# EAGLE design goodfet31L (EAGLE 5.08)
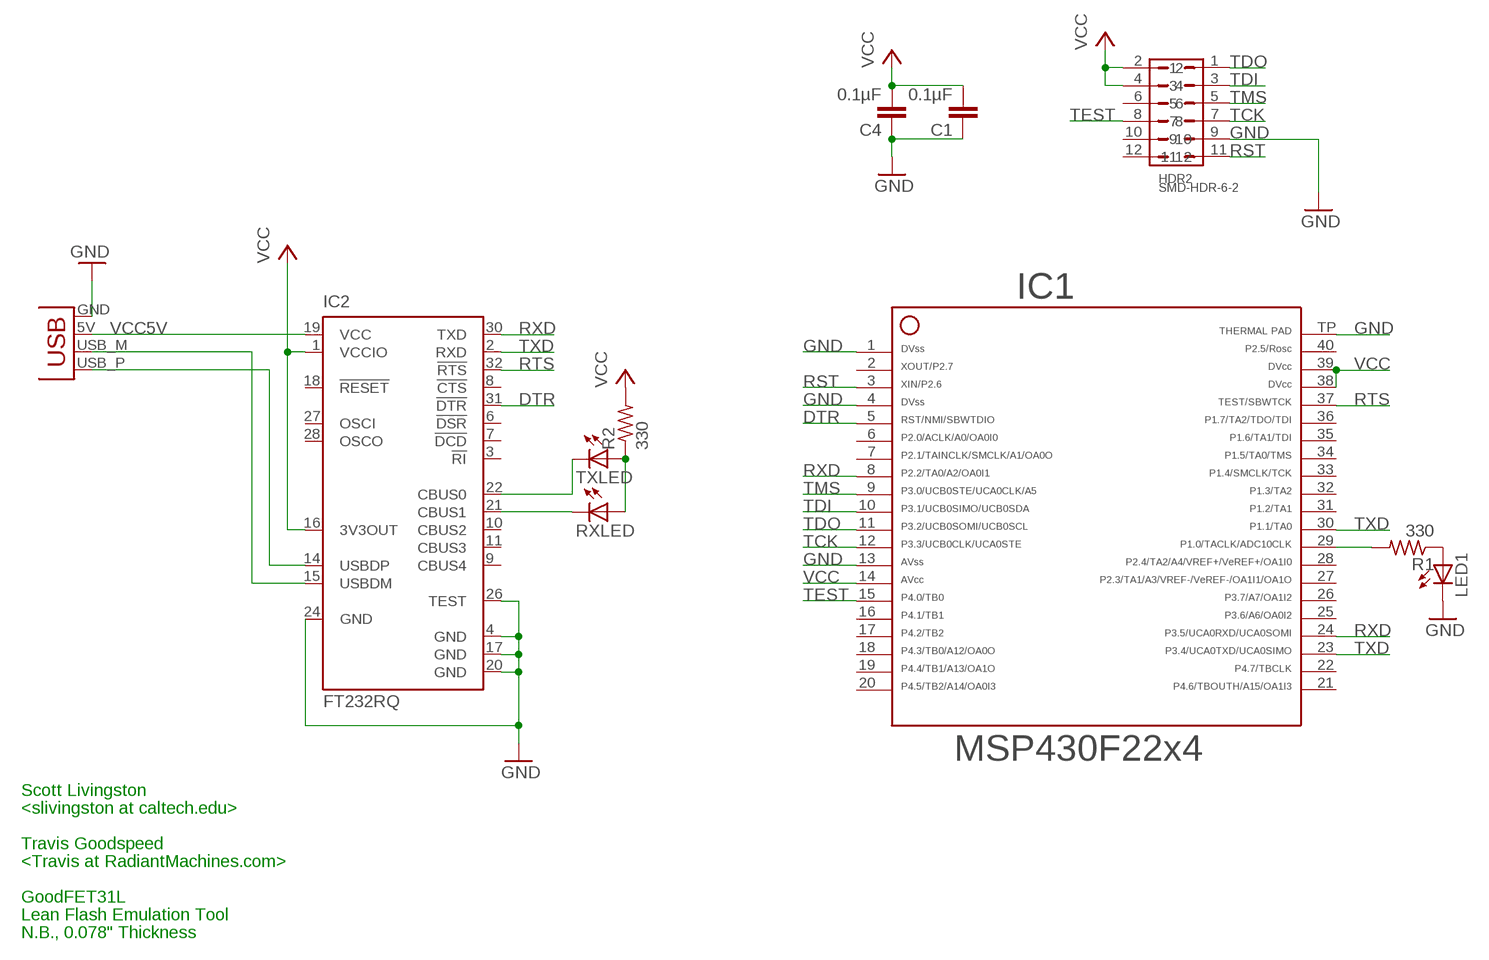
[diagram p0: schematic, sheet 1]

## Parts
C1  0.1µF  C-EUC0603  [C0603]
C4  0.1µF  C-EUC0603  [C0603]
HDR2  SMD-HDR-6-2  [SMD-HDR-6-2]
IC1  F22X4---RHA40  [RHA40]
IC2  FT232RQ  [QFN32]
LED1  LEDCHIP-LED0603  [CHIP-LED0603]
R1  330  R-US_R0603  [R0603]
R2  330  R-US_R0603  [R0603]
RXLED  LEDCHIP-LED0603  [CHIP-LED0603]
TXLED  LEDCHIP-LED0603  [CHIP-LED0603]
X1  USBPCB  [USB-A-PCB]

## Nets
DTR: IC1.5 IC2.31(!DTR)
GND: C1.1 C4.1 HDR2.9 IC1.1 IC1.4 IC1.13 IC1.TP IC2.4(GND) IC2.17(GND) IC2.20(GND) IC2.24(GND) IC2.26(TEST) LED1.C X1.GND
N$1: IC1.29 R1.2
N$2: IC2.21(CBUS1) RXLED.C
N$3: IC2.14(USBDP) X1.USB_P(D+)
N$4: IC2.15(USBDM) X1.USB_M(D-)
N$5: IC2.22(CBUS0) TXLED.C
N$8: R2.1 RXLED.A TXLED.A
N$10: LED1.A R1.1
RST: HDR2.11 IC1.3
RTS: IC1.37 IC2.32(!RTS)
RXD: IC1.8 IC1.24 IC2.30(TXD)
TCK: HDR2.7 IC1.12
TDI: HDR2.3 IC1.10
TDO: HDR2.1 IC1.11
TEST: HDR2.8 IC1.15
TMS: HDR2.5 IC1.9
TXD: IC1.23 IC1.30 IC2.2(RXD)
VCC: C1.2 C4.2 HDR2.2 HDR2.4 IC1.14 IC1.38 IC1.39 IC2.1(VCCIO) IC2.16(3V3OUT) R2.2
VCC5V: IC2.19(VCC) X1.5V(VBUS)
Unconnected: HDR2.6 HDR2.10 HDR2.12 IC1.2 IC1.6 IC1.7 IC1.16 IC1.17 IC1.18 IC1.19 IC1.20 IC1.21 IC1.22 IC1.25 IC1.26 IC1.27 IC1.28 IC1.31 IC1.32 IC1.33 IC1.34 IC1.35 IC1.36 IC1.40 IC2.3(!RI) IC2.6(!DSR) IC2.7(!DCD) IC2.8(!CTS) IC2.9(CBUS4) IC2.10(CBUS2) IC2.11(CBUS3) IC2.18(!RESET) IC2.27(OSCI) IC2.28(OSCO)

## Notes on the sheet
- Scott Livingston
- <slivingston at caltech.edu>
- Travis Goodspeed
- <Travis at RadiantMachines.com>
- GoodFET31L
- Lean Flash Emulation Tool
- N.B., 0.078" Thickness

## Library data of the parts
C1 C4 = rcl:C-EU: CAPACITOR, European symbol
HDR2 = scott_eagle:SMD-HDR-6-2
IC1 = TI_MSP430_v13:F22X4---RHA40: ***MSP430F22x4***RHA40
IC2 = ftdichip:FT232R: Source: http://www.ftdichip.com/Documents/DataSheets/DS_FT232R_v104.pdf
LED1 RXLED TXLED = led:LED: LED OSRAM: - CHIPLED LG R971, LG N971, LY N971, LG Q971, LY Q971, LO R971, LY R971 LH N974, LH R974 LS Q976, LO Q976, LY Q976 LO Q996 - Hyper CHIPLED LW Q18S LB Q993, LB Q99A, LB R99A - SideLED LS A670, LO A670, LY A670, LG A670, LP A670 LB A673, LV A673, LT A673, LW A673 LH A674 LY A675 LS A676, LA A676, LO A676, LY A676, LW A676 LS A679, LY A679, LG A679 - Hyper Micro SIDELED® LS Y876, LA Y876, LO Y876, LY Y876 LT Y87S - SmartLED LW L88C, LW L88S LB L89C, LB L89S, LG L890 LS L89K, LO L89K, LY L89K LS L896, LA L896, LO L896, LY L896 - TOPLED LS T670, LO T670, LY T670, LG T670, LP T670 LSG T670, LSP T670, LSY T670, LOP T670, LYG T670 LG T671, LOG T671, LSG T671 LB T673, LV T673, LT T673, LW T673 LH T674 LS T676, LA T676, LO T676, LY T676, LB T676, LH T676, LSB T676, LW T676 LB T67C, LV T67C, LT T67C, LS T67K, LO T67K, LY T67K, LW E67C LS E67B, LA E67B, LO E67B, LY E67B, LB E67C, LV E67C, LT E67C LW T67C LS T679, LY T679, LG T679 LS T770, LO T770, LY T770, LG T770, LP T770 LB T773, LV T773, LT T773, LW T773 LH T774 LS E675, LA E675, LY E675, LS T675 LS T776, LA T776, LO T776, LY T776, LB T776 LHGB T686 LT T68C, LB T68C - Hyper Mini TOPLED® LB M676 - Mini TOPLED Santana® LG M470 LS M47K, LO M47K, LY M47K Source: http://www.osram.convergy.de LUXEON: - LUMILED® LXK2-PW12-R00, LXK2-PW12-S00, LXK2-PW14-U00, LXK2-PW14-V00 LXK2-PM12-R00, LXK2-PM12-S00, LXK2-PM14-U00 LXK2-PE12-Q00, LXK2-PE12-R00, LXK2-PE12-S00, LXK2-PE14-T00, LXK2-PE14-U00 LXK2-PB12-K00, LXK2-PB12-L00, LXK2-PB12-M00, LXK2-PB14-N00, LXK2-PB14-P00, LXK2-PB14-Q00 LXK2-PR12-L00, LXK2-PR12-M00, LXK2-PR14-Q00, LXK2-PR14-R00 LXK2-PD12-Q00, LXK2-PD12-R00, LXK2-PD12-S00 LXK2-PH12-R00, LXK2-PH12-S00 LXK2-PL12-P00, LXK2-PL12-Q00, LXK2-PL12-R00 Source: www.luxeon.com KINGBRIGHT: KA-3528ASYC Source: www.kingbright.com
R1 R2 = rcl:R-US_: RESISTOR, American symbol
X1 = SparkFun:USB: USB Connectors USB-B-PTH is fully proven SKU : PRT-00139 USB-miniB is fully proven SKU : PRT-00587 USB-A-PCB is untested. USB-A-H is throughly reviewed, but untested. Spark Fun Electronics SKU : PRT-00437 USB-B-SMT is throughly reviewed, but untested. Needs silkscreen touching up. USB-A-S has not been used/tested USB-MB-H has not been used/tested

## Board
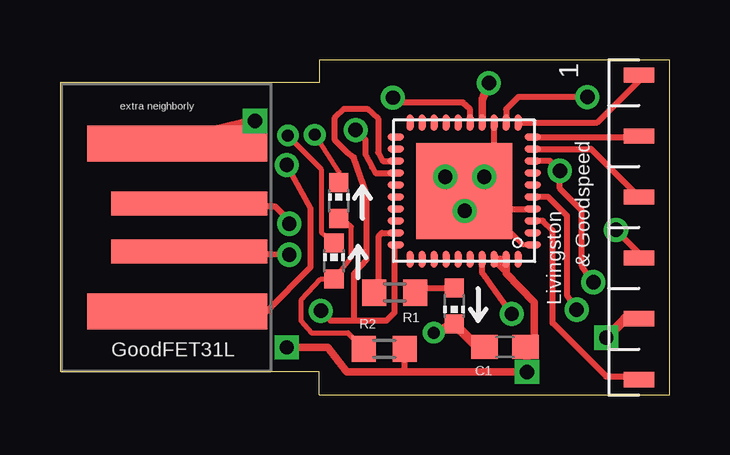
[diagram p1: board, top side]
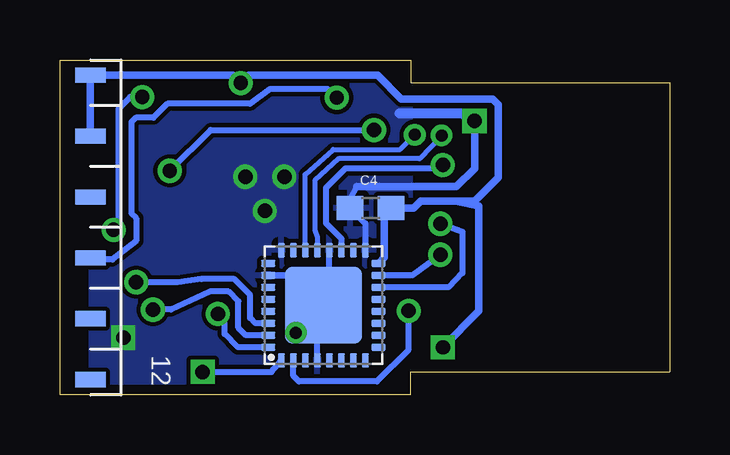
[diagram p2: board, bottom side, seen from below]

Size 25.4 x 13.97 mm. Coordinates in mm from the lower left corner, seen from the top.
Outline: 10.79,0 25.4,0 25.4,13.97 10.79,13.97 10.79,13.02 0,13.02 0,0.95 10.79,0.95 10.79,0
Copper layers (1*16): Top 0.035mm / dielectric 1.5mm / Bottom 0.035mm
Design rules "gf": minimum track width 7mil, minimum drill 15mil, track to track 7mil, track to pad 7mil, pad to pad 7mil, via to via 7mil, smd to smd 7mil, copper to edge 17mil, drill to drill 8mil, minimum pad ring 10mil, minimum via ring 8mil, stop-mask expansion 4mil, vias tented up to drill 0mil, thermal gap 10mil

### Footprints (pad centres in the part's own frame; a part is rotated, then mirrored left to right if it is on the bottom)
C0603 = smd 1.1 x 1: 1 -0.85,0; 2 0.85,0
SMD-HDR-6-2 = smd 1.27 x 0.635: 1 1.27,6.35; 3 1.27,3.81; 5 1.27,1.27; 7 1.27,-1.27; 9 1.27,-3.81; 11 1.27,-6.35 | smd 1.27 x 0.635 bottom: 2 1.27,6.35; 4 1.27,3.81; 6 1.27,1.27; 8 1.27,-1.27; 10 1.27,-3.81; 12 1.27,-6.35
RHA40 = smd 0.7 x 0.3: 1 -2.85,2.25; 2 -2.85,1.75; 3 -2.85,1.25; 4 -2.85,0.75; 5 -2.85,0.25; 6 -2.85,-0.25; 7 -2.85,-0.75; 8 -2.85,-1.25; 9 -2.85,-1.75; 10 -2.85,-2.25; 21 2.85,-2.25; 22 2.85,-1.75; 23 2.85,-1.25; 24 2.85,-0.75; 25 2.85,-0.25; 26 2.85,0.25; 27 2.85,0.75; 28 2.85,1.25; 29 2.85,1.75; 30 2.85,2.25 | smd 0.3 x 0.7: 11 -2.25,-2.85; 12 -1.75,-2.85; 13 -1.25,-2.85; 14 -0.75,-2.85; 15 -0.25,-2.85; 16 0.25,-2.85; 17 0.75,-2.85; 18 1.25,-2.85; 19 1.75,-2.85; 20 2.25,-2.85; 31 2.25,2.85; 32 1.75,2.85; 33 1.25,2.85; 34 0.75,2.85; 35 0.25,2.85; 36 -0.25,2.85; 37 -0.75,2.85; 38 -1.25,2.85; 39 -1.75,2.85; 40 -2.25,2.85 | smd 4 x 4: TP 0,0
QFN32 = smd 0.6 x 0.3: 1 -2.3,1.75; 2 -2.3,1.25; 3 -2.3,0.75; 4 -2.3,0.25; 5 -2.3,-0.25; 6 -2.3,-0.75; 7 -2.3,-1.25; 8 -2.3,-1.75; 17 2.3,-1.75; 18 2.3,-1.25; 19 2.3,-0.75; 20 2.3,-0.25; 21 2.3,0.25; 22 2.3,0.75; 23 2.3,1.25; 24 2.3,1.75 | smd 0.3 x 0.6: 9 -1.75,-2.3; 10 -1.25,-2.3; 11 -0.75,-2.3; 12 -0.25,-2.3; 13 0.25,-2.3; 14 0.75,-2.3; 15 1.25,-2.3; 16 1.75,-2.3; 25 1.75,2.3; 26 1.25,2.3; 27 0.75,2.3; 28 0.25,2.3; 29 -0.25,2.3; 30 -0.75,2.3; 31 -1.25,2.3; 32 -1.75,2.3 | smd 3.2 x 3.2: EXP 0,0
CHIP-LED0603 = smd 0.8 x 0.8: A 0,-0.75; C 0,0.75
R0603 = smd 1 x 1.1: 1 -0.85,0; 2 0.85,0
USB-A-PCB = smd 7.5 x 1.5: 5V -0.2,-3.5; GND -0.2,3.5 | smd 6.5 x 1: USB_M 0.3,-1; USB_P 0.3,1

### Placement (x,y rotation side)
C1  18.54,1.99 0 top
C4  12.46,7.79 0 bottom
HDR2  22.86,6.99 0 top
IC1  16.84,8.51 180 top
IC2  14.43,3.73 90 bottom
LED1  16.42,3.71 180 top
R1  13.94,4.27 180 top
R2  13.51,1.92 0 top
RXLED  11.42,5.59 0 top
TXLED  11.62,8.1 0 top
X1  5.08,6.99 0 top

### Tracks (layer width: path | path; a pad name or v marks a point on that pad's centre or on a via)
DTR  (via drill 0.6)
  Top 0.254: IC1.5 20.34,8.26 21.13,7.47 21.13,4.15 v21.53,3.56
  Bottom 0.254: IC2.31 17.66,2.48 17.97,2.79 17.97,3.9 18.38,4.3 19.16,4.3 20.78,3.56 v21.53,3.56
GND  (via drill 0.5, 0.6)
  Top 0.203: IC1.1 19.29,6.26 18.67,6.88 18.67,7.76 | 17.59,7.76 16.95,7.76 v16.87,7.67 | 18.09,9.76 18.09,9.51 v17.68,9.09
  Top 0.254: IC1.13 18.09,9.76 IC1.TP 17.59,7.76 18.67,7.76 IC1.4
  Top 0.406: HDR2.9 23.55,3.18 v22.76,2.39 | v8.13,11.43 5.11,10.72 X1.GND | C1.1 17.39,1.99 LED1.C v15.57,2.59
  Bottom 0.254: IC2.4 14.68,3 | IC2.20 14.18,5.08 14.68,4.58 | 14.68,4.58 15.09,4.98 | 14.68,3 v15.57,2.59 | 14.68,3 14.68,4.58 | IC2.17 12.68,7.15 C4.1 13.31,8.18 13.03,8.69
  Bottom 0.279: 15.09,4.98 IC2.26
  Bottom 0.305: 13.03,8.69 8.89,8.69 8.13,9.45 v8.13,11.43
  Bottom 0.406: v8.13,11.43 8.66,11.74 11.25,11.74
  other vias: 16.05,9.09
  pour Bottom: 10.82,13.64 10.82,0.38 24.08,0.38 24.08,13.64
N$1
  Top 0.254: IC1.29 13.41,6.76 13.28,6.63 13.28,4.46 R1.2
N$2  (via drill 0.5)
  Top 0.203: RXLED.C 10.91,6.74 10.9,6.83 10.9,9.4 v9.5,10.82
  Bottom 0.203: IC2.21 14.68,6.57 14.78,6.88 14.78,8.94 13.79,9.86 10.41,9.86 v9.5,10.82
N$3  (via drill 0.6)
  Top 0.254: v9.55,7.14 9.55,7.26 8.94,7.87 5.49,7.87 X1.USB_P
  Top 0.406: X1.USB_P 5.39,7.98
  Bottom 0.254: IC2.14 9.21,4.48 8.64,5.08 8.64,6.81 v9.55,7.14
N$4  (via drill 0.6)
  Top 0.254: 5.5,5.87 8.71,5.87 v9.55,5.84
  Top 0.406: 5.4,5.97 X1.USB_M 5.5,5.87
  Bottom 0.254: IC2.15 10.71,4.98 v9.55,5.84
N$5  (via drill 0.5)
  Top 0.203: TXLED.C 11.62,9.3 v10.62,10.85
  Bottom 0.203: IC2.22 15.18,6.26 15.19,6.5 15.19,9.2 14.02,10.24 11.23,10.24 v10.62,10.85
N$8
  Top 0.203: R2.1 11.99,2.59 10.46,2.59 10.06,3.07 10.06,3.96 10.87,4.83 RXLED.A 12.14,5.74 12.14,7.01 11.75,7.35 TXLED.A
N$10
  Top 0.254: R1.1 14.99,4.46 LED1.A
RST
  Top 0.254: IC1.3 20.12,7.26 20.52,6.86 20.52,3 22.76,0.76 24,0.76 HDR2.11
RTS  (via drill 0.6)
  Top 0.254: IC1.37 17.59,5.11 v18.82,3.38
  Bottom 0.254: IC2.32 17.99,1.98 18.54,2.54 18.54,2.98 v18.82,3.38
RXD  (via drill 0.6)
  Top 0.254: v22.23,4.7 21.74,5.38 21.74,7.7 20.83,8.61 v20.83,9.35 20.42,9.76 IC1.8 | IC1.24 13.14,9.26 13.01,9.5 12.72,10.03 12.72,10.64 v12.32,11.05 12.29,11.02
  Bottom 0.254: IC2.30 17.26,2.98 17.48,3.2 17.48,4.17 18.14,4.83 19.51,4.83 20.5,4.7 v22.23,4.7 | v12.32,11.05 19.13,11.05 v20.83,9.35
TCK  (via drill 0.6)
  Top 0.254: 24.11,5.71 HDR2.7 24.13,5.89 v23.16,6.88 | IC1.12 18.59,11.91 19.1,12.42 v21.97,12.42
  Bottom 0.254: v23.16,6.88 22.96,7.26 22.96,11.94 22.48,12.42 v21.97,12.42
TDI
  Top 0.254: 23.96,10.96 HDR2.3 24.09,10.76 IC1.10
TDO
  Top 0.254: 24.38,13.36 24.11,13.36 HDR2.1 24.13,13.11 22.38,11.36 IC1.11
TEST  (via drill 0.6)
  Top 0.254: IC1.15 17.09,11.92 16.79,12.19 14.28,12.19 v13.87,12.39
  Bottom 0.254: HDR2.8 24,5.64 23.22,5.64 22.23,6.43 22.23,7.37 22.43,7.57 22.43,11.38 22.25,11.56 21.51,11.56 20.93,12.14 17.48,12.14 16.66,12.75 14.22,12.75 v13.87,12.39
TMS
  Top 0.254: 24.11,8.28 HDR2.5 22.13,10.26 IC1.9
TXD  (via drill 0.6)
  Top 0.254: IC1.30 13.95,6.21 13.95,3.43 13.61,3.1 12.27,3.1 | IC1.23 13.46,9.76 13.26,10.11 13.26,11.53 12.8,11.94 11.84,11.94 11.46,11.56 11.46,10.62 11.96,10.11 12.24,9.91 12.78,8.36 12.78,5.64 12.27,5.08 12.27,3.1 | v10.87,3.51 11.28,3.1 12.27,3.1
  Bottom 0.254: IC2.2 15.68,0.79 15.44,0.56 12.19,0.56 10.87,1.88 v10.87,3.51
VCC  (via drill 0.6)
  Top 0.254: IC1.39 IC1.38 | R2.2 14.36,1.1 14.22,0.96
  Top 0.305: IC1.39 18.59,5.06 19.76,3.86 19.76,2.31 C1.2 19.46,1.93 v19.46,0.95 19.44,0.96 14.22,0.96 11.94,0.96 11.15,1.98 v9.45,1.98 | IC1.38 18.49,5.26 | IC1.14 17.59,12.32 v17.87,13.01
  Bottom 0.254: IC2.1 16.59,0.95 v19.46,0.95
  Bottom 0.305: v9.45,1.98 7.95,3.51 7.95,7.87 8.94,8.08 | IC2.16 11.89,5.72 11.89,7.51 C4.2 10.65,7.79 10.36,8.08 8.94,8.08 | HDR2.4 HDR2.2 18.2,13.34 v17.87,13.01 17.54,13.34 12.17,13.34 11.18,12.34 7.37,12.34 7.14,12.12 7.14,9.07 8.13,8.08 8.94,8.08
VCC5V  (via drill 0.6)
  Top 0.254: X1.5V 8.62,3.48 10.44,5.33 10.44,7.77 v9.45,9.59
  Bottom 0.254: IC2.19 13.68,6.51 14.33,7.16 14.33,8.64 13.51,9.45 9.56,9.45 v9.45,9.59

### Text on the board
tPlace: extra neighborly | & Goodspeed | Livingston | GoodFET31L